# Altium schematic sheet Sheet1.SchDoc
size A4
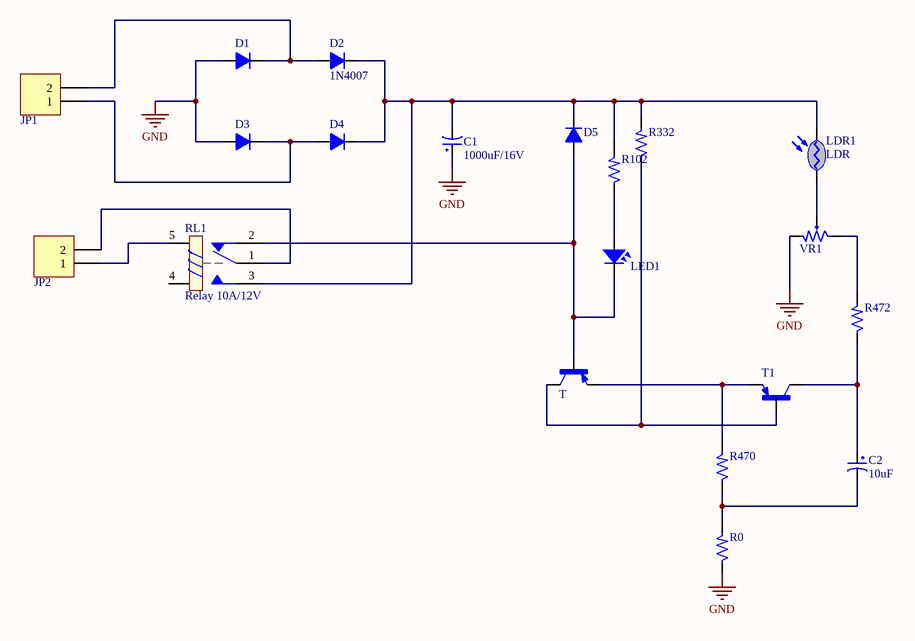
[diagram p0: Sheet1.SchDoc]

## Parts
C1  1000uF/16V  [CP1.5/3.4]
C2  10uF  [CP1/2]
D1  1N4007  [D1A]  (value not drawn)
D2  1N4007  [D1A]
D3  1N4007  [D1A]  (value not drawn)
D4  1N4007  [D1A]  (value not drawn)
D5  1N4007  [D1A]  (value not drawn)
JP1  Header 2_1  [HED2]  (value not drawn)
JP2  Header 2_1  [HED2]  (value not drawn)
LDR1  LDR  [CDS]
LED1  LED  [LED-3]  (value not drawn)
R0  1k  [SM-RES-1206]  (value not drawn)
R102  1k  [SM-RES-1206]  (value not drawn)
R332  1k  [SM-RES-1206]  (value not drawn)
R470  1k  [SM-RES-1206]  (value not drawn)
R472  1k  [SM-RES-1206]  (value not drawn)
RL1  Relay 10A/12V  [RL_SPDT_10A]
T  BC858C  [SOT23]  (value not drawn)
T1  BC858C  [SOT23]  (value not drawn)
VR1  10K  [VR]  (value not drawn)

## Nets
GND: C1.1 D1.1(A) D3.1(A) R0.1 VR1.1
NetC1_2: C1.2 D2.2(K) D4.2(K) D5.2(K) LDR1.2(K) R102.2 R332.2 RL1.3
NetC2_1: C2.1 R472.1 T1.3(C)
NetC2_2: C2.2 R0.2 R470.1
NetD1_2: D1.2(K) D2.1(A) JP1.2
NetD3_2: D3.2(K) D4.1(A) JP1.1
NetD5_1: D5.1(A) LED1.2 RL1.2 T.1(B)
NetJP2_1: JP2.1 RL1.5
NetJP2_2: JP2.2 RL1.1
NetLDR1_1: LDR1.1(A) VR1.2
NetLED1_1: LED1.1 R102.1
NetR332_1: R332.1 T.3(C) T1.1(B)
NetR470_2: R470.2 T.2(E) T1.2(E)
NetR472_2: R472.2 VR1.3

Not connected (* = marked no-connect by the designer): RL1 4

## Library data of the parts
C1 = CP4: Cap 1000uF/16V - 220uF/50V; Description 5: 4,7uF>10uF/250V_3,3uF>10uF/400V - 2,2uF>4,7uF/450V; Description 1: 2200uF-3300uF/6,3V - 1000uF-2200uF/10V; Description 2: 1000uF/16V - 470uF => 1000uF/25V - 100uF/100V; Description 3: 330uF>470uF/35V_220uF>470uF/50V_10uF>22uF/250V; Description 4: 220uF => 330uF/63V - 10uF =>33uF/160 - 200V; Value: 1000uF/16V
C2 = CP1: Cap P  0,1uF < 22uF , 16 - 50V; Value: 10uF/50V; Description 1: 10 => 220uF/6,3V/10V - 10uF => 100uF/16V; Description 2: 0,1uF => 33uF/50V - 10uF => 22uF/63V; Description 3: 0,47uF => 10uF/100V
D1-D5 = D1A: Diode 1A; Value: 1N4007
JP1 JP2 = Header 2_1: Header, 2-Pin; Manufacturer: Generic Components; Class: Connector; Value: Header 2
LDR1 = LDR: Quang Tro
LED1 = LED: LED Single colour Green and Red; Value: LED 3 ly Single Colour
R0 R102 R332 R470 R472 = R: Resistor 1/4W; Value: R1/4W - 1K
RL1 = Relay 1: Relay SPDT,10A - 12VDC 5 Pin; Value: Relay SPDT, 10A, 12V
T T1 = BC858C: Bipolar _BJT_ Transistor PNP 30V 100mA 150MHz 310mW Surface Mount SOT-23-3; MF: ON Semiconductor; Price: None; Package: SOT-23 Diotec; MP: BC858C; Value: *; Availability: Unavailable; SnapEDA_Link: https://www.snapeda.com/parts/BC858C/ON%20Semiconductor/view-part/885150/?ref=snap
VR1 = VR1: Var Resistor; Value: VR 10K